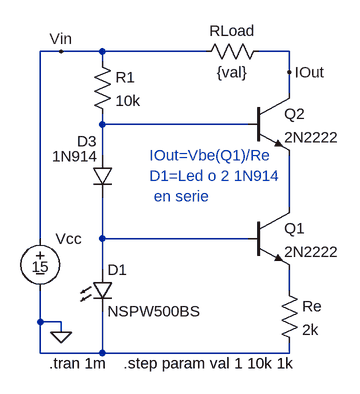
[diagram p0: schematic 2q&3DioConstCorr.asc]
2q&3DioConstCorr.asc, the LTspice schematic file:
Version 4
SHEET 1 880 680
WIRE -224 32 -256 32
WIRE -160 32 -224 32
WIRE 0 32 -160 32
WIRE 128 32 80 32
WIRE -160 48 -160 32
WIRE 128 64 128 32
WIRE 128 96 128 64
WIRE -160 144 -160 128
WIRE 64 144 -160 144
WIRE -160 192 -160 144
WIRE 128 272 128 192
WIRE -256 320 -256 32
WIRE -160 320 -160 256
WIRE 64 320 -160 320
WIRE -160 368 -160 320
WIRE 128 400 128 368
WIRE -256 448 -256 400
WIRE -224 448 -256 448
WIRE -224 464 -224 448
WIRE -256 496 -256 448
WIRE -160 496 -160 432
WIRE -160 496 -256 496
WIRE 128 496 128 480
WIRE 128 496 -160 496
FLAG -224 464 0
FLAG 128 64 IOut
FLAG -224 32 Vin
SYMBOL npn 64 272 R0
SYMATTR InstName Q1
SYMATTR Value 2N2222
SYMBOL npn 64 96 R0
SYMATTR InstName Q2
SYMATTR Value 2N2222
SYMBOL res 112 384 R0
SYMATTR InstName Re
SYMATTR Value 2k
SYMBOL res -176 32 R0
SYMATTR InstName R1
SYMATTR Value 10k
SYMBOL diode -176 192 R0
WINDOW 0 -23 -22 Left 0
WINDOW 3 -62 1 Left 0
SYMATTR InstName D3
SYMATTR Value 1N914
SYMBOL voltage -256 304 R0
WINDOW 3 -13 59 Left 0
SYMATTR Value 15
SYMATTR InstName Vcc
SYMBOL res 96 16 R90
WINDOW 0 0 56 VBottom 0
WINDOW 3 32 56 VTop 0
SYMATTR InstName RLoad
SYMATTR Value {val}
SYMBOL LED -176 368 R0
SYMATTR InstName D1
SYMATTR Value NSPW500BS
TEXT -88 192 Left 0 ;IOut=Vbe(Q1)/Re\nD1=Led o 2 1N914\n en serie
TEXT -242 512 Left 0 !.tran 1m
TEXT -128 512 Left 0 !.step param val 1 10k 1k

The netlist it stands for:
* 2q&3DioConstCorr.asc
Q1 N002 N003 N004 0 2N2222
Q2 IOut N001 N002 0 2N2222
Re N004 0 2k
R1 Vin N001 10k
D3 N001 N003 1N914
Vcc Vin 0 15
RLoad IOut Vin {val}
D1 N003 0 NSPW500BS
.model D D
.lib standard.dio
.model NPN NPN
.model PNP PNP
.lib standard.bjt
* IOut=Vbe(Q1)/Re
* D1=Led o 2 1N914
*  en serie
.tran 1m
.step param val 1 10k 1k
.backanno
.end